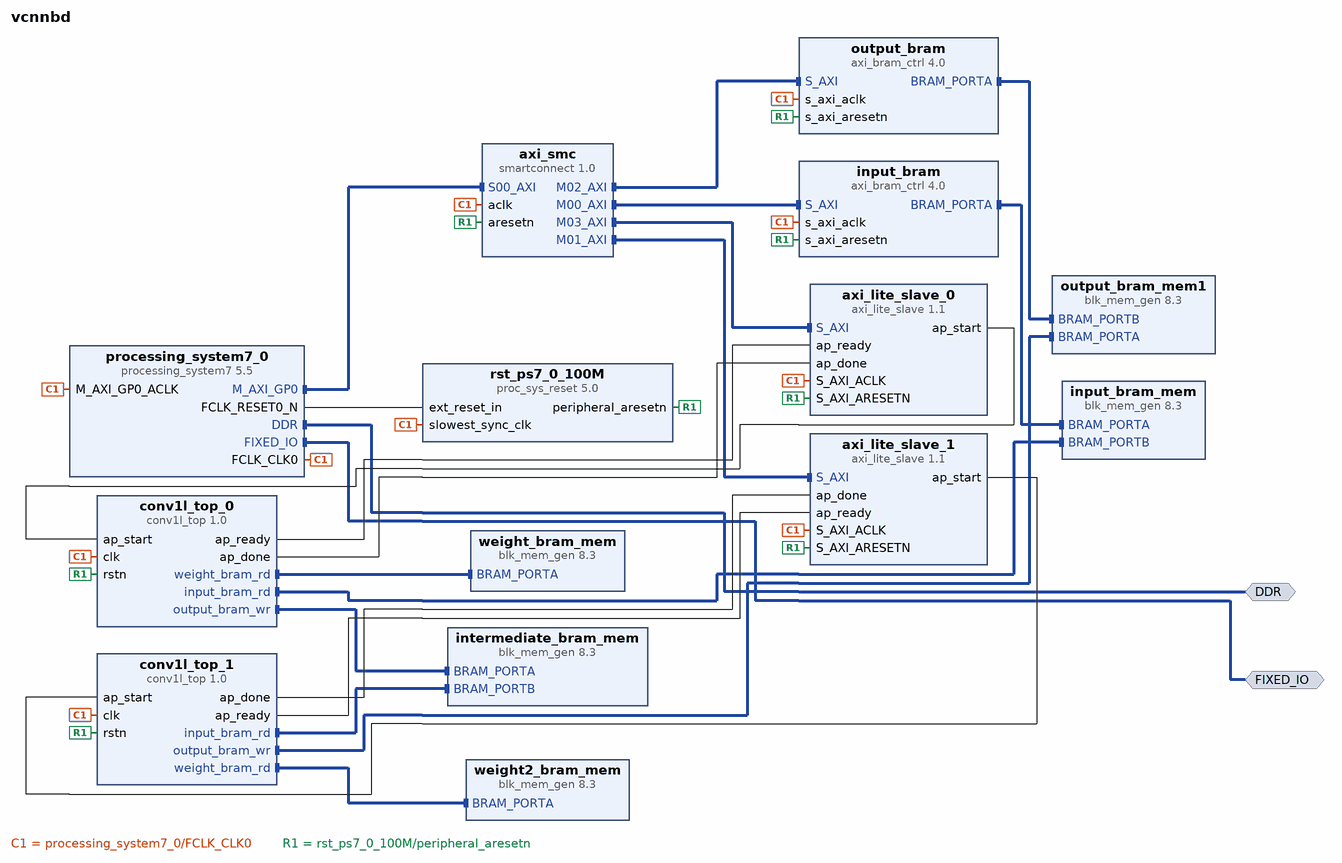
[diagram p0: block diagram of the top level]
# Vivado block design vcnnbd, xc7z020clg400-1, Vivado 2017.2
create_bd_design vcnnbd

create_bd_intf_port -mode Master -vlnv xilinx.com:interface:ddrx_rtl:1.0 DDR
create_bd_intf_port -mode Master -vlnv xilinx.com:display_processing_system7:fixedio_rtl:1.0 FIXED_IO

create_bd_cell -type ip -vlnv xilinx.com:ip:processing_system7:5.5 processing_system7_0
set_property -dict {CONFIG.PCW_FPGA0_PERIPHERAL_FREQMHZ 100} [get_bd_cells processing_system7_0]
create_bd_cell -type ip -vlnv xilinx.com:ip:blk_mem_gen:8.3 input_bram_mem
set_property -dict [list \
  CONFIG.Memory_Type True_Dual_Port_RAM \
  CONFIG.Enable_32bit_Address false \
  CONFIG.Use_Byte_Write_Enable true \
  CONFIG.Byte_Size 8 \
  CONFIG.Assume_Synchronous_Clk true \
  CONFIG.Write_Width_A 32 \
  CONFIG.Write_Depth_A 1536 \
  CONFIG.Read_Width_A 32 \
  CONFIG.Enable_A Always_Enabled \
  CONFIG.Write_Width_B 16 \
  CONFIG.Read_Width_B 16 \
  CONFIG.Enable_B Always_Enabled \
  CONFIG.Register_PortA_Output_of_Memory_Primitives false \
  CONFIG.Register_PortB_Output_of_Memory_Primitives true \
  CONFIG.Register_PortB_Output_of_Memory_Core false \
  CONFIG.Load_Init_File true \
  CONFIG.Coe_File input_bram.coe \
  CONFIG.Fill_Remaining_Memory_Locations true \
  CONFIG.Remaining_Memory_Locations BAD5BADA \
  CONFIG.Use_RSTA_Pin false \
  CONFIG.Use_RSTB_Pin false \
  CONFIG.Port_B_Clock 100 \
  CONFIG.Port_B_Write_Rate 50 \
  CONFIG.Port_B_Enable_Rate 100 \
  CONFIG.use_bram_block Stand_Alone \
] [get_bd_cells input_bram_mem]
create_bd_cell -type ip -vlnv xilinx.com:ip:axi_bram_ctrl:4.0 input_bram
set_property -dict {CONFIG.SINGLE_PORT_BRAM 1} [get_bd_cells input_bram]
create_bd_cell -type ip -vlnv xilinx.com:ip:smartconnect:1.0 axi_smc
set_property -dict {CONFIG.NUM_MI 4 CONFIG.NUM_SI 1} [get_bd_cells axi_smc]
create_bd_cell -type ip -vlnv xilinx.com:ip:proc_sys_reset:5.0 rst_ps7_0_100M
create_bd_cell -type ip -vlnv dots.com:dots:axi_lite_slave:1.1 axi_lite_slave_0
create_bd_cell -type ip -vlnv xilinx.com:ip:blk_mem_gen:8.3 weight_bram_mem
set_property -dict [list \
  CONFIG.Memory_Type Single_Port_ROM \
  CONFIG.Enable_32bit_Address false \
  CONFIG.Write_Width_A 16 \
  CONFIG.Write_Depth_A 512 \
  CONFIG.Enable_A Always_Enabled \
  CONFIG.Register_PortA_Output_of_Memory_Primitives true \
  CONFIG.Load_Init_File true \
  CONFIG.Coe_File weight_bram.coe \
  CONFIG.Fill_Remaining_Memory_Locations true \
  CONFIG.Remaining_Memory_Locations 0 \
  CONFIG.Use_RSTA_Pin false \
  CONFIG.Port_A_Write_Rate 0 \
  CONFIG.Port_B_Clock 0 \
  CONFIG.Port_B_Write_Rate 0 \
  CONFIG.Port_B_Enable_Rate 0 \
  CONFIG.use_bram_block Stand_Alone \
] [get_bd_cells weight_bram_mem]
create_bd_cell -type ip -vlnv xilinx.com:ip:axi_bram_ctrl:4.0 output_bram
set_property -dict {CONFIG.SINGLE_PORT_BRAM 1} [get_bd_cells output_bram]
create_bd_cell -type ip -vlnv xilinx.com:ip:blk_mem_gen:8.3 intermediate_bram_mem
set_property -dict [list \
  CONFIG.Memory_Type True_Dual_Port_RAM \
  CONFIG.Enable_32bit_Address false \
  CONFIG.Use_Byte_Write_Enable true \
  CONFIG.Byte_Size 8 \
  CONFIG.Assume_Synchronous_Clk true \
  CONFIG.Write_Width_A 16 \
  CONFIG.Write_Depth_A 16384 \
  CONFIG.Read_Width_A 16 \
  CONFIG.Enable_A Always_Enabled \
  CONFIG.Write_Width_B 16 \
  CONFIG.Read_Width_B 16 \
  CONFIG.Enable_B Always_Enabled \
  CONFIG.Register_PortA_Output_of_Memory_Primitives true \
  CONFIG.Register_PortB_Output_of_Memory_Primitives true \
  CONFIG.Fill_Remaining_Memory_Locations true \
  CONFIG.Remaining_Memory_Locations FA52 \
  CONFIG.Use_RSTA_Pin true \
  CONFIG.Use_RSTB_Pin false \
  CONFIG.Port_B_Clock 100 \
  CONFIG.Port_B_Write_Rate 50 \
  CONFIG.Port_B_Enable_Rate 100 \
  CONFIG.use_bram_block Stand_Alone \
] [get_bd_cells intermediate_bram_mem]
create_bd_cell -type ip -vlnv xilinx.com:ip:blk_mem_gen:8.3 weight2_bram_mem
set_property -dict [list \
  CONFIG.Memory_Type Single_Port_ROM \
  CONFIG.Enable_32bit_Address false \
  CONFIG.Write_Width_A 16 \
  CONFIG.Write_Depth_A 5120 \
  CONFIG.Enable_A Always_Enabled \
  CONFIG.Register_PortA_Output_of_Memory_Primitives true \
  CONFIG.Load_Init_File true \
  CONFIG.Coe_File ../conv2_weights.coe \
  CONFIG.Fill_Remaining_Memory_Locations true \
  CONFIG.Remaining_Memory_Locations 0 \
  CONFIG.Use_RSTA_Pin false \
  CONFIG.Port_A_Write_Rate 0 \
  CONFIG.Port_B_Clock 0 \
  CONFIG.Port_B_Write_Rate 0 \
  CONFIG.Port_B_Enable_Rate 0 \
  CONFIG.use_bram_block Stand_Alone \
] [get_bd_cells weight2_bram_mem]
create_bd_cell -type ip -vlnv xilinx.com:ip:blk_mem_gen:8.3 output_bram_mem1
set_property -dict [list \
  CONFIG.Memory_Type True_Dual_Port_RAM \
  CONFIG.Enable_32bit_Address false \
  CONFIG.Use_Byte_Write_Enable true \
  CONFIG.Byte_Size 8 \
  CONFIG.Assume_Synchronous_Clk true \
  CONFIG.Write_Width_A 16 \
  CONFIG.Write_Depth_A 32768 \
  CONFIG.Read_Width_A 16 \
  CONFIG.Enable_A Always_Enabled \
  CONFIG.Write_Width_B 16 \
  CONFIG.Read_Width_B 16 \
  CONFIG.Enable_B Use_ENB_Pin \
  CONFIG.Register_PortA_Output_of_Memory_Primitives true \
  CONFIG.Register_PortB_Output_of_Memory_Primitives false \
  CONFIG.Fill_Remaining_Memory_Locations true \
  CONFIG.Remaining_Memory_Locations 0000 \
  CONFIG.Use_RSTA_Pin false \
  CONFIG.Use_RSTB_Pin false \
  CONFIG.Port_B_Clock 100 \
  CONFIG.Port_B_Write_Rate 50 \
  CONFIG.Port_B_Enable_Rate 100 \
  CONFIG.use_bram_block Stand_Alone \
] [get_bd_cells output_bram_mem1]
create_bd_cell -type ip -vlnv dots.com:dots:axi_lite_slave:1.1 axi_lite_slave_1
create_bd_cell -type ip -vlnv user.org:user:conv1l_top:1.0 conv1l_top_0
set_property -dict [list \
  CONFIG.INPUT_ADDR_WIDTH 12 \
  CONFIG.WEIGHT_ADDR_WIDTH 9 \
  CONFIG.WEIGHT_FLTRS_COUNT 16 \
  CONFIG.OUTPUT_ADDR_WIDTH 14 \
  CONFIG.OUTPUT_ROWS_COUNT 32 \
  CONFIG.OUTPUT_CHNLS_COUNT 16 \
] [get_bd_cells conv1l_top_0]
create_bd_cell -type ip -vlnv user.org:user:conv1l_top:1.0 conv1l_top_1
set_property -dict [list \
  CONFIG.INPUT_ADDR_WIDTH 14 \
  CONFIG.INPUT_CHNLS_COUNT 16 \
  CONFIG.WEIGHT_ADDR_WIDTH 13 \
  CONFIG.WEIGHT_FLTRS_COUNT 32 \
  CONFIG.OUTPUT_ADDR_WIDTH 15 \
  CONFIG.OUTPUT_ROWS_COUNT 32 \
  CONFIG.OUTPUT_CHNLS_COUNT 32 \
  CONFIG.CONV_ICHNLS_WIDTH 5 \
  CONFIG.CONV_WFLTRS_WIDTH 6 \
] [get_bd_cells conv1l_top_1]

# ---- connections ----

connect_bd_intf_net [get_bd_intf_pins processing_system7_0/M_AXI_GP0] [get_bd_intf_pins axi_smc/S00_AXI]
connect_bd_intf_net [get_bd_intf_pins input_bram_mem/BRAM_PORTB] [get_bd_intf_pins conv1l_top_0/input_bram_rd]
connect_bd_intf_net [get_bd_intf_pins axi_smc/M00_AXI] [get_bd_intf_pins input_bram/S_AXI]
connect_bd_intf_net [get_bd_intf_pins axi_smc/M02_AXI] [get_bd_intf_pins output_bram/S_AXI]
connect_bd_intf_net [get_bd_intf_pins axi_smc/M03_AXI] [get_bd_intf_pins axi_lite_slave_0/S_AXI]
connect_bd_intf_net -intf_net axi_bram_ctrl_0_BRAM_PORTA [get_bd_intf_pins input_bram/BRAM_PORTA] [get_bd_intf_pins input_bram_mem/BRAM_PORTA]
connect_bd_intf_net [get_bd_intf_pins intermediate_bram_mem/BRAM_PORTA] [get_bd_intf_pins conv1l_top_0/output_bram_wr]
connect_bd_intf_net [get_bd_intf_pins intermediate_bram_mem/BRAM_PORTB] [get_bd_intf_pins conv1l_top_1/input_bram_rd]
connect_bd_intf_net [get_bd_intf_pins conv1l_top_1/weight_bram_rd] [get_bd_intf_pins weight2_bram_mem/BRAM_PORTA]
connect_bd_intf_net -intf_net axi_smc_M04_AXI [get_bd_intf_pins axi_smc/M01_AXI] [get_bd_intf_pins axi_lite_slave_1/S_AXI]
connect_bd_intf_net [get_bd_intf_pins output_bram_mem1/BRAM_PORTA] [get_bd_intf_pins conv1l_top_1/output_bram_wr]
connect_bd_intf_net [get_bd_intf_pins output_bram_mem1/BRAM_PORTB] [get_bd_intf_pins output_bram/BRAM_PORTA]
connect_bd_intf_net [get_bd_intf_pins weight_bram_mem/BRAM_PORTA] [get_bd_intf_pins conv1l_top_0/weight_bram_rd]
connect_bd_intf_net [get_bd_intf_ports DDR] [get_bd_intf_pins processing_system7_0/DDR]
connect_bd_intf_net [get_bd_intf_ports FIXED_IO] [get_bd_intf_pins processing_system7_0/FIXED_IO]
connect_bd_net [get_bd_pins processing_system7_0/FCLK_CLK0] \
  [get_bd_pins processing_system7_0/M_AXI_GP0_ACLK] [get_bd_pins axi_smc/aclk] [get_bd_pins input_bram/s_axi_aclk] \
  [get_bd_pins rst_ps7_0_100M/slowest_sync_clk] [get_bd_pins axi_lite_slave_0/S_AXI_ACLK] \
  [get_bd_pins output_bram/s_axi_aclk] [get_bd_pins axi_lite_slave_1/S_AXI_ACLK] [get_bd_pins conv1l_top_0/clk] \
  [get_bd_pins conv1l_top_1/clk]
connect_bd_net [get_bd_pins rst_ps7_0_100M/peripheral_aresetn] \
  [get_bd_pins input_bram/s_axi_aresetn] [get_bd_pins axi_smc/aresetn] [get_bd_pins axi_lite_slave_0/S_AXI_ARESETN] \
  [get_bd_pins output_bram/s_axi_aresetn] [get_bd_pins axi_lite_slave_1/S_AXI_ARESETN] [get_bd_pins conv1l_top_0/rstn] \
  [get_bd_pins conv1l_top_1/rstn]
connect_bd_net [get_bd_pins processing_system7_0/FCLK_RESET0_N] [get_bd_pins rst_ps7_0_100M/ext_reset_in]
connect_bd_net [get_bd_pins axi_lite_slave_0/ap_start] [get_bd_pins conv1l_top_0/ap_start]
connect_bd_net [get_bd_pins conv1l_top_0/ap_ready] [get_bd_pins axi_lite_slave_0/ap_ready]
connect_bd_net [get_bd_pins conv1l_top_0/ap_done] [get_bd_pins axi_lite_slave_0/ap_done]
connect_bd_net [get_bd_pins axi_lite_slave_1/ap_start] [get_bd_pins conv1l_top_1/ap_start]
connect_bd_net [get_bd_pins conv1l_top_1/ap_done] [get_bd_pins axi_lite_slave_1/ap_done]
connect_bd_net [get_bd_pins conv1l_top_1/ap_ready] [get_bd_pins axi_lite_slave_1/ap_ready]

# ---- address map ----
assign_bd_address -offset 0x40000000 -range 4K -target_address_space [get_bd_addr_spaces processing_system7_0/Data] [get_bd_addr_segs input_bram/S_AXI/Mem0]
assign_bd_address -offset 0x43C00000 -range 4K -target_address_space [get_bd_addr_spaces processing_system7_0/Data] [get_bd_addr_segs axi_lite_slave_0/S_AXI/reg0]
assign_bd_address -offset 0x43C10000 -range 4K -target_address_space [get_bd_addr_spaces processing_system7_0/Data] [get_bd_addr_segs axi_lite_slave_1/S_AXI/reg0]
assign_bd_address -offset 0x44000000 -range 32K -target_address_space [get_bd_addr_spaces processing_system7_0/Data] [get_bd_addr_segs output_bram/S_AXI/Mem0]

validate_bd_design
save_bd_design
